# EAGLE design Distributer (EAGLE 8.0.0)
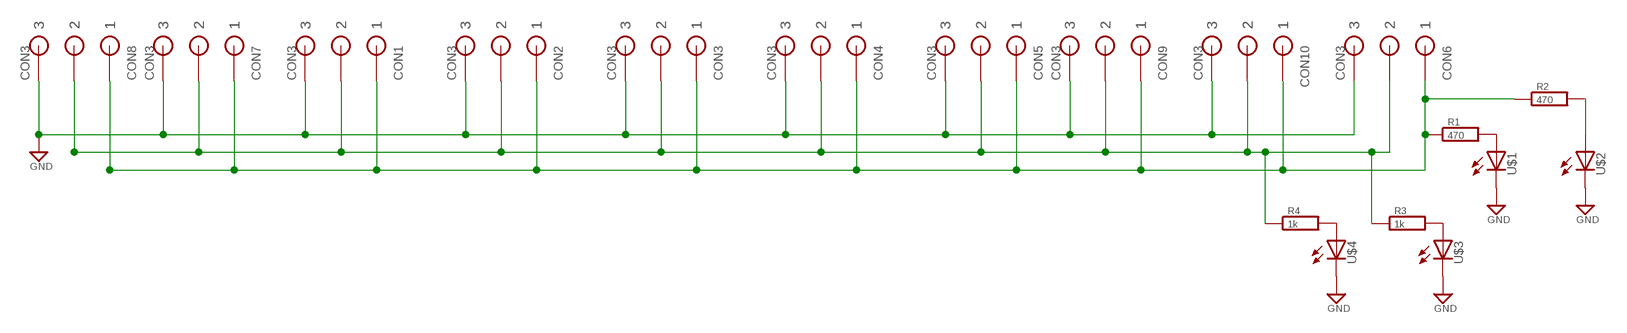
[diagram p0: schematic, sheet 1]

## Parts
CON1  CON3  [CON3]
CON2  CON3  [CON3]
CON3  CON3  [CON3]
CON4  CON3  [CON3]
CON5  CON3  [CON3]
CON6  CON3  [CON3]
CON7  CON3  [CON3]
CON8  CON3  [CON3]
CON9  CON3  [CON3]
CON10  CON3  [CON3]
R1  470  抵抗0805  [0805]
R2  470  抵抗0805  [0805]
R3  1k  抵抗0805  [0805]
R4  1k  抵抗0805  [0805]
U$1  LED(砲弾型)3  [LED3MM]
U$2  LED(砲弾型)3  [LED3MM]
U$3  LED(砲弾型)3  [LED3MM]
U$4  LED(砲弾型)3  [LED3MM]

## Nets
GND: CON1.P$3 CON2.P$3 CON3.P$3 CON4.P$3 CON5.P$3 CON6.P$3 CON7.P$3 CON8.P$3 CON9.P$3 CON10.P$3 U$1.K U$2.K U$3.K U$4.K
N$1: CON1.P$1 CON2.P$1 CON3.P$1 CON4.P$1 CON5.P$1 CON6.P$1 CON7.P$1 CON8.P$1 CON9.P$1 CON10.P$1 R1.1 R2.1
N$2: CON1.P$2 CON2.P$2 CON3.P$2 CON4.P$2 CON5.P$2 CON6.P$2 CON7.P$2 CON8.P$2 CON9.P$2 CON10.P$2 R3.1 R4.1
N$3: R2.2 U$2.A
N$4: R3.2 U$3.A
N$5: R4.2 U$4.A
N$7: R1.2 U$1.A

## Library data of the parts
CON1-CON10 = (コネクタ)XH:CON3: low insertion CON
R1-R4 = (Foundation)表面実装RC:抵抗
U$1-U$4 = (半導体)LED:LED(砲弾型)

## Board
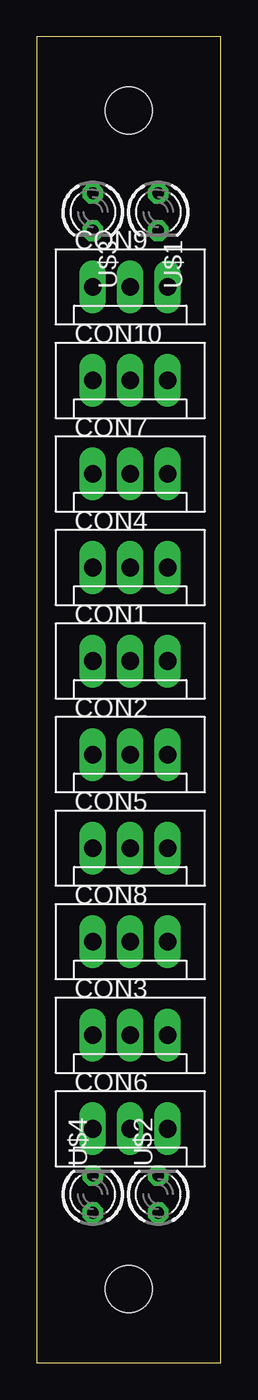
[diagram p1: board, top side]
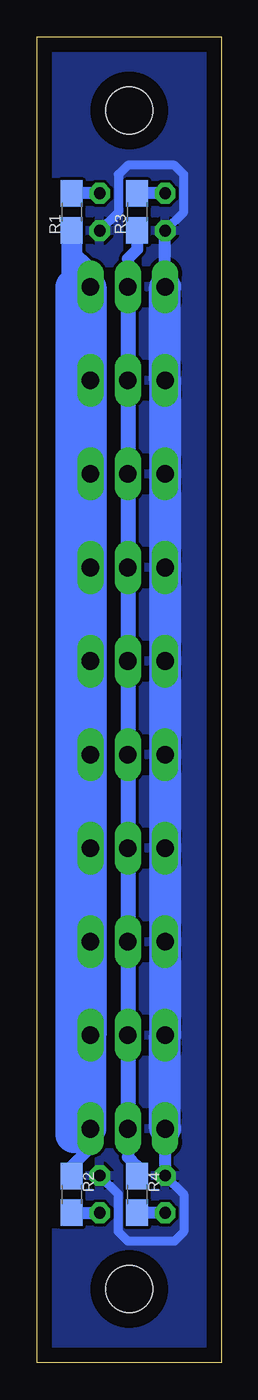
[diagram p2: board, bottom side, seen from below]

Size 12.5 x 90 mm. Coordinates in mm from the lower left corner, seen from the top.
Outline: 0,0 12.5,0 12.5,90 0,90 0,0
Copper layers (1*16): Top 0.035mm / dielectric 1.5mm / Bottom 0.035mm
Design rules "default": minimum track width 10mil, minimum drill 24mil, track to track 8mil, track to pad 8mil, pad to pad 8mil, via to via 8mil, smd to smd 8mil, copper to edge 40mil, drill to drill 8mil, minimum pad ring 10mil, minimum via ring 8mil, stop-mask expansion 4mil, vias tented up to drill 0mil, thermal gap 10mil
Holes 3.2 mm at 6.25,5 6.25,85

### Footprints (pad centres in the part's own frame; a part is rotated, then mirrored left to right if it is on the bottom)
CON3 = drill 1.2 long: P$1 2.54,0; P$2 0,0; P$3 -2.54,0
0805 = smd 1.8 x 1.5: 1 -1.25,0; 2 1.25,0
LED3MM = drill 0.813 pad 1.422 octagon: A -1.27,0; K 1.27,0

### Placement (x,y rotation side)
CON1  6.35,47.62 0 top
CON2  6.35,41.27 0 top
CON3  6.35,22.23 0 top
CON4  6.35,53.98 0 top
CON5  6.35,34.92 0 top
CON6  6.35,15.88 0 top
CON7  6.35,60.33 0 top
CON8  6.35,28.57 0 top
CON9  6.35,73.03 0 top
CON10  6.35,66.67 0 top
R1  10.16,78.11 90 bottom
R2  10.16,11.43 270 bottom
R3  5.71,78.11 90 bottom
R4  5.71,11.43 270 bottom
U$1  8.26,78.11 270 top
U$2  8.26,11.43 90 top
U$3  3.81,78.11 270 top
U$4  3.81,11.43 90 top

### Tracks (layer width: path | path; a pad name or v marks a point on that pad's centre or on a via)
GND
  Bottom 0.61: U$3.K 2.54,78.11 2.54,80.64 3.17,81.28 6.35,81.28 6.99,80.64 6.99,78.11 U$1.K | U$4.K 2.54,11.43 2.54,8.89 3.17,8.26 6.35,8.26 6.99,8.89 6.99,11.43 U$2.K
  Bottom 0.813: CON9.P$3 U$3.K | CON6.P$3 U$4.K
  Bottom 2.184: CON9.P$3 CON10.P$3 CON7.P$3 CON4.P$3 CON1.P$3 CON2.P$3 CON5.P$3 CON8.P$3 CON3.P$3 CON6.P$3
  pour Bottom: 0,90 12.5,90 12.5,0 0,0
N$1
  Bottom 0.813: R1.1 10.16,75.56 8.89,74.3 CON9.P$1 | CON6.P$1 8.89,14.61 10.16,13.34 R2.1
  Bottom 1.27: 10,15.5 9.27,15.5 CON6.P$1
  Bottom 1.422: R1.1 10.16,73.16 10,73
  Bottom 2.184: CON9.P$1 CON10.P$1 CON7.P$1 CON4.P$1 CON1.P$1 | CON1.P$1 8.89,46.35 | CON1.P$1 CON2.P$1 CON5.P$1 CON8.P$1 CON3.P$1 CON6.P$1
  Bottom 2.54: 10,73 10,15.5
N$2
  Bottom 0.813: R3.1 5.71,75.56 6.35,74.93 CON9.P$2 | R4.1 5.71,13.34 6.35,13.97 CON6.P$2
  Bottom 1.016: CON9.P$2 CON10.P$2 CON7.P$2 CON4.P$2 CON1.P$2 CON2.P$2 CON5.P$2 CON8.P$2 CON3.P$2 CON6.P$2
N$3
  Bottom 0.813: R2.2 8.28,10.18 U$2.A
N$4
  Bottom 0.813: U$3.A 5.7,79.38 R3.2
N$5
  Bottom 0.813: U$4.A 5.7,10.16 R4.2
N$7
  Bottom 0.813: U$1.A 10.14,79.38 R1.2